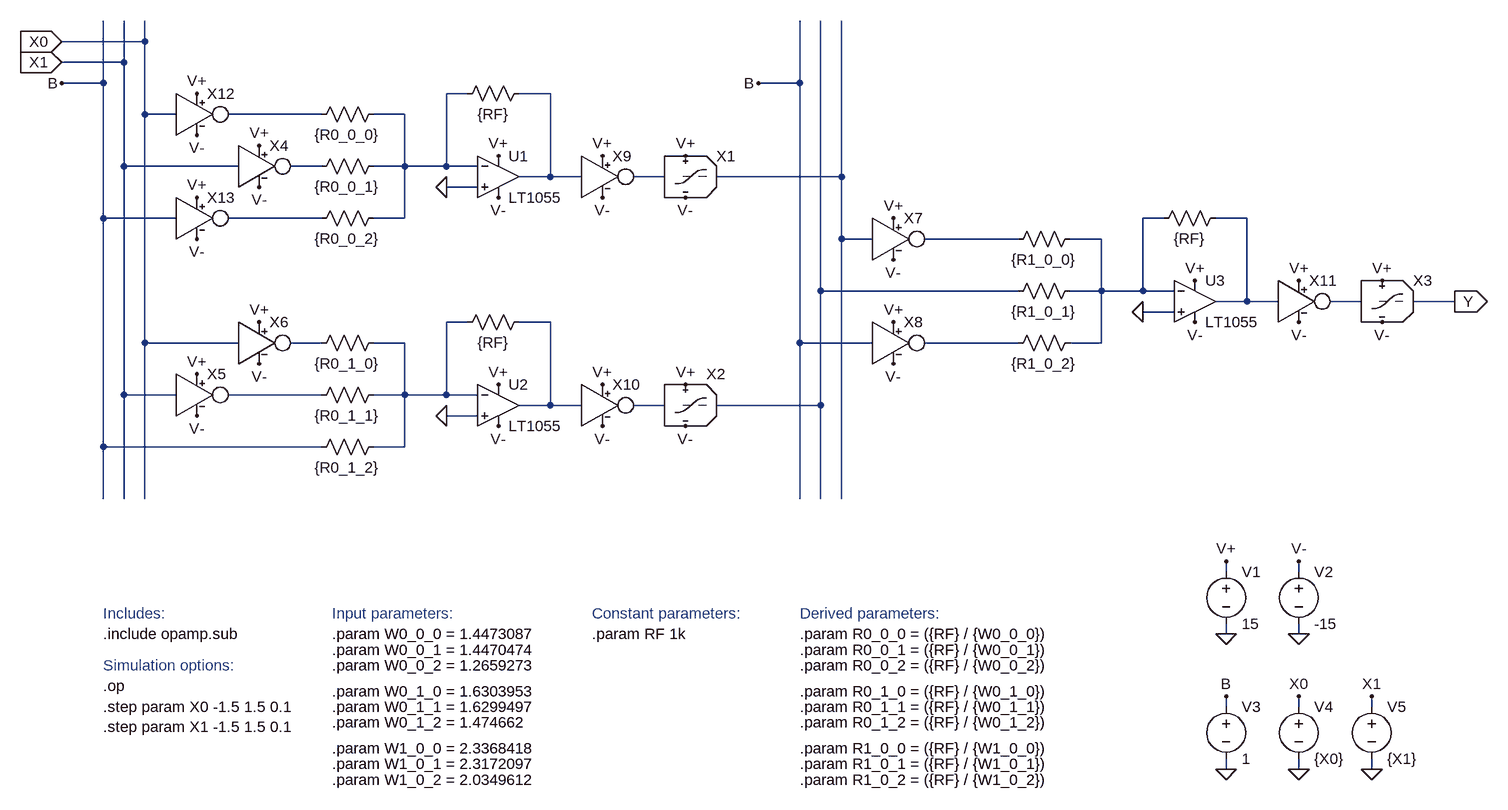
[diagram p0: schematic xor.asc]
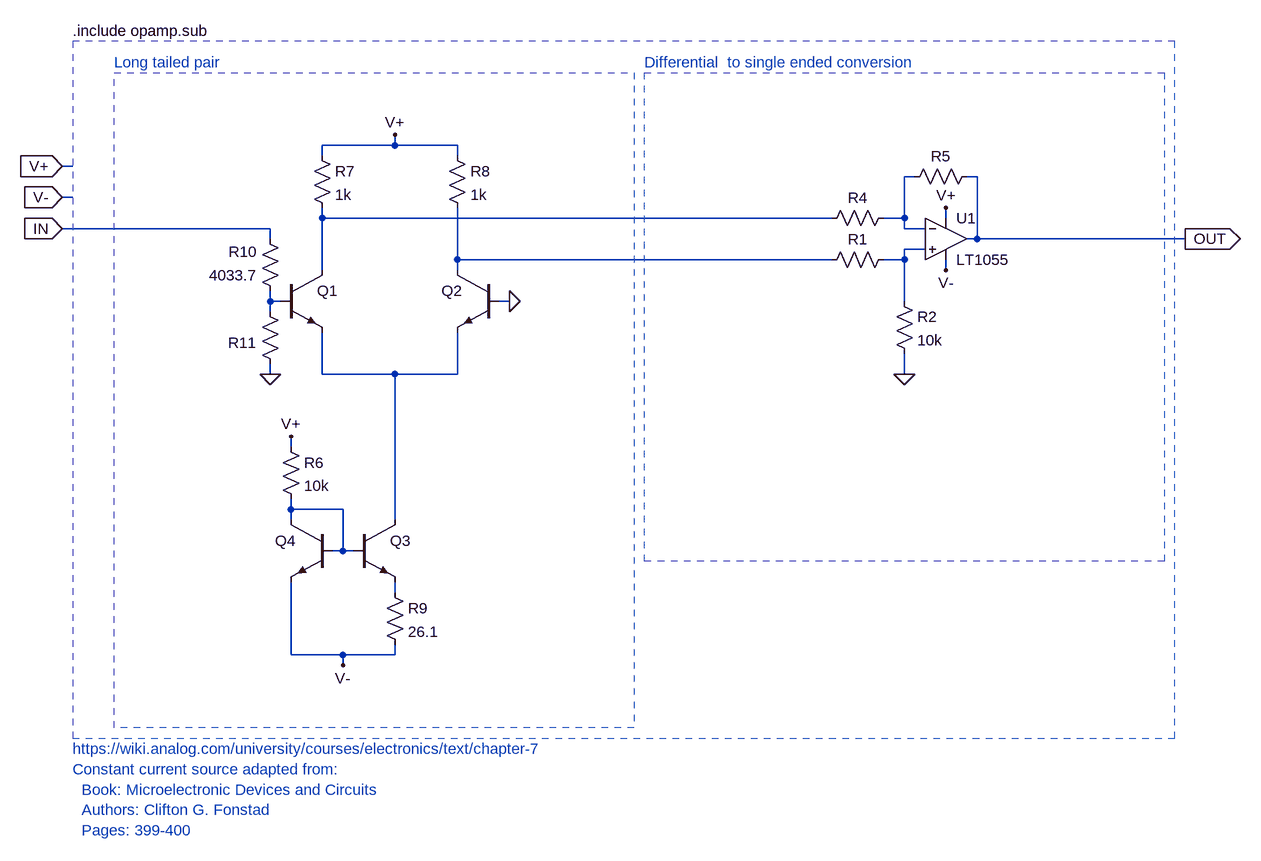
[diagram p1: sub-circuit tanh.asc]
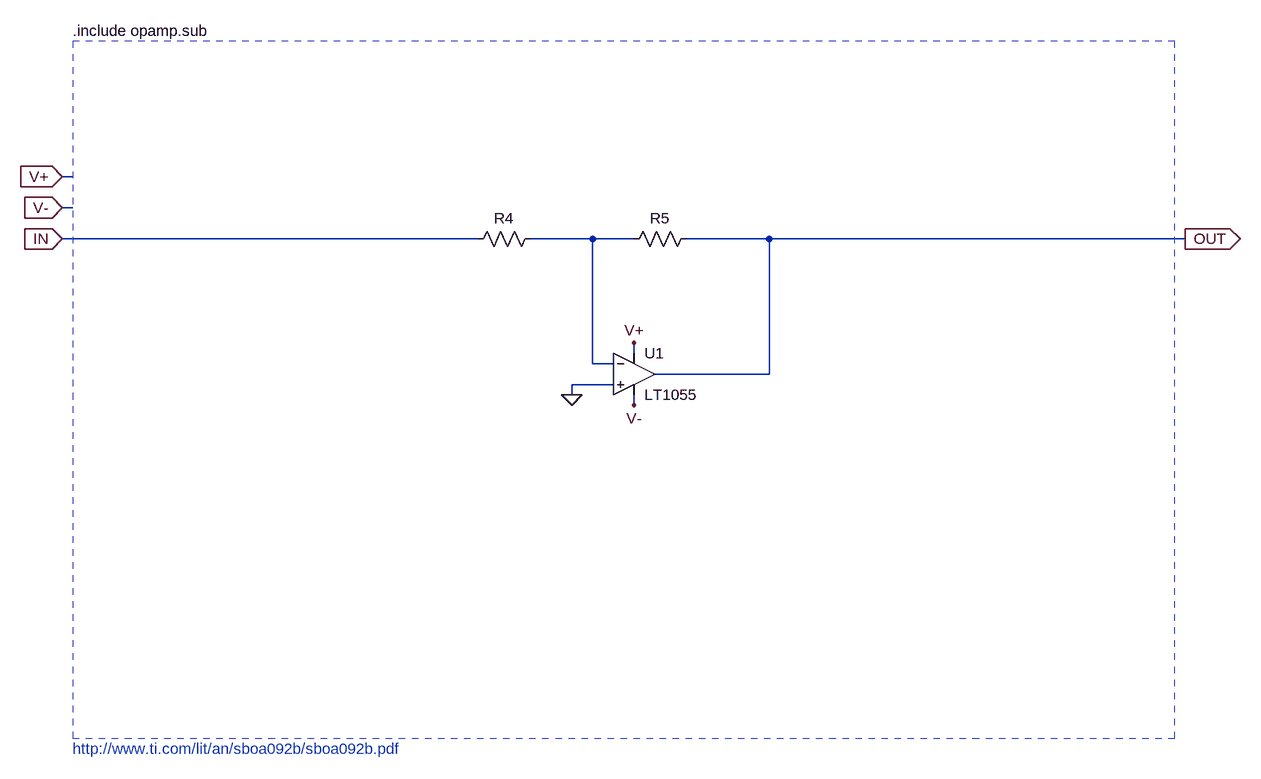
[diagram p2: sub-circuit inverter.asc]
xor.asc, the LTspice schematic file:
Version 4
SHEET 1 2576 948
WIRE -336 -448 -336 -480
WIRE -336 -448 -464 -448
WIRE -368 -416 -368 -480
WIRE -368 -416 -464 -416
WIRE -400 -384 -400 -480
WIRE -400 -384 -464 -384
WIRE 672 -384 672 -480
WIRE 672 -384 608 -384
WIRE 160 -368 128 -368
WIRE 288 -368 240 -368
WIRE -336 -336 -336 -448
WIRE -288 -336 -336 -336
WIRE -64 -336 -208 -336
WIRE 64 -336 16 -336
WIRE -368 -256 -368 -416
WIRE -192 -256 -368 -256
WIRE -64 -256 -112 -256
WIRE 64 -256 64 -336
WIRE 64 -256 16 -256
WIRE 128 -256 128 -368
WIRE 128 -256 64 -256
WIRE 176 -256 128 -256
WIRE 288 -240 288 -368
WIRE 288 -240 240 -240
WIRE 336 -240 288 -240
WIRE 464 -240 416 -240
WIRE 736 -240 736 -480
WIRE 736 -240 544 -240
WIRE 176 -224 128 -224
WIRE -400 -176 -400 -384
WIRE -288 -176 -400 -176
WIRE -64 -176 -208 -176
WIRE 64 -176 64 -256
WIRE 64 -176 16 -176
WIRE 1232 -176 1200 -176
WIRE 1360 -176 1312 -176
WIRE 736 -144 736 -240
WIRE 784 -144 736 -144
WIRE 1008 -144 864 -144
WIRE 1136 -144 1088 -144
WIRE 704 -64 704 -480
WIRE 1008 -64 704 -64
WIRE 1136 -64 1136 -144
WIRE 1136 -64 1088 -64
WIRE 1200 -64 1200 -176
WIRE 1200 -64 1136 -64
WIRE 1248 -64 1200 -64
WIRE 1360 -48 1360 -176
WIRE 1360 -48 1312 -48
WIRE 1408 -48 1360 -48
WIRE 1536 -48 1488 -48
WIRE 1680 -48 1616 -48
WIRE 1248 -32 1200 -32
WIRE 160 -16 128 -16
WIRE 288 -16 240 -16
WIRE -336 16 -336 -336
WIRE -192 16 -336 16
WIRE -64 16 -112 16
WIRE 64 16 16 16
WIRE 672 16 672 -384
WIRE 784 16 672 16
WIRE 1008 16 864 16
WIRE 1136 16 1136 -64
WIRE 1136 16 1088 16
WIRE -368 96 -368 -256
WIRE -288 96 -368 96
WIRE -64 96 -208 96
WIRE 64 96 64 16
WIRE 64 96 16 96
WIRE 128 96 128 -16
WIRE 128 96 64 96
WIRE 176 96 128 96
WIRE 288 112 288 -16
WIRE 288 112 240 112
WIRE 336 112 288 112
WIRE 464 112 416 112
WIRE 704 112 704 -64
WIRE 704 112 544 112
WIRE 176 128 128 128
WIRE -400 176 -400 -176
WIRE -64 176 -400 176
WIRE 64 176 64 96
WIRE 64 176 16 176
WIRE -400 256 -400 176
WIRE -368 256 -368 96
WIRE -336 256 -336 16
WIRE 672 256 672 16
WIRE 704 256 704 112
WIRE 736 256 736 -144
WIRE 1328 368 1328 352
WIRE 1440 368 1440 352
WIRE 1328 464 1328 448
WIRE 1440 464 1440 448
WIRE 1328 576 1328 560
WIRE 1440 576 1440 560
WIRE 1552 576 1552 560
WIRE 1328 672 1328 656
WIRE 1440 672 1440 656
WIRE 1552 672 1552 656
FLAG -464 -448 X0
IOPIN -464 -448 In
FLAG -464 -416 X1
IOPIN -464 -416 In
FLAG -464 -384 B
FLAG 208 -272 V+
FLAG 208 -208 V-
FLAG 128 -224 0
FLAG 208 80 V+
FLAG 208 144 V-
FLAG 128 128 0
FLAG 608 -384 B
FLAG 1280 -80 V+
FLAG 1280 -16 V-
FLAG 1200 -32 0
FLAG 1680 -48 Y
IOPIN 1680 -48 Out
FLAG 496 -272 V+
FLAG 496 80 V+
FLAG 1568 -80 V+
FLAG 496 -208 V-
FLAG 496 144 V-
FLAG 1568 -16 V-
FLAG 1328 464 0
FLAG 1440 464 0
FLAG 1328 352 V+
FLAG 1440 352 V-
FLAG 1328 672 0
FLAG 1440 672 0
FLAG 1552 672 0
FLAG 1440 560 X0
FLAG 1552 560 X1
FLAG 1328 560 B
FLAG -160 -288 V+
FLAG -160 -224 V-
FLAG -256 64 V+
FLAG -256 128 V-
FLAG -160 -16 V+
FLAG -160 48 V-
FLAG 816 -176 V+
FLAG 816 -112 V-
FLAG 816 -16 V+
FLAG 816 48 V-
FLAG 368 -272 V+
FLAG 368 -208 V-
FLAG 368 80 V+
FLAG 368 144 V-
FLAG 1440 -80 V+
FLAG 1440 -16 V-
FLAG -256 -368 V+
FLAG -256 -304 V-
FLAG -256 -208 V+
FLAG -256 -144 V-
SYMBOL res 32 -352 R90
WINDOW 0 -14 42 Invisible 2
WINDOW 3 32 56 VTop 2
SYMATTR InstName R1
SYMATTR Value {R0_0_0}
SYMBOL res 32 -272 R90
WINDOW 0 0 56 Invisible 2
WINDOW 3 32 56 VTop 2
SYMATTR InstName R2
SYMATTR Value {R0_0_1}
SYMBOL res 32 -192 R90
WINDOW 0 0 56 Invisible 2
WINDOW 3 32 56 VTop 2
SYMATTR InstName R3
SYMATTR Value {R0_0_2}
SYMBOL res 256 -384 R90
WINDOW 0 -14 42 Invisible 2
WINDOW 3 32 56 VTop 2
SYMATTR InstName R4
SYMATTR Value {RF}
SYMBOL res 32 0 R90
WINDOW 0 -14 42 Invisible 2
WINDOW 3 32 56 VTop 2
SYMATTR InstName R5
SYMATTR Value {R0_1_0}
SYMBOL res 32 80 R90
WINDOW 0 0 56 Invisible 2
WINDOW 3 32 56 VTop 2
SYMATTR InstName R6
SYMATTR Value {R0_1_1}
SYMBOL res 32 160 R90
WINDOW 0 0 56 Invisible 2
WINDOW 3 32 56 VTop 2
SYMATTR InstName R7
SYMATTR Value {R0_1_2}
SYMBOL res 256 -32 R90
WINDOW 0 -14 42 Invisible 2
WINDOW 3 32 56 VTop 2
SYMATTR InstName R8
SYMATTR Value {RF}
SYMBOL res 1104 -160 R90
WINDOW 0 -14 42 Invisible 2
WINDOW 3 32 56 VTop 2
SYMATTR InstName R9
SYMATTR Value {R1_0_0}
SYMBOL res 1104 -80 R90
WINDOW 0 0 56 Invisible 2
WINDOW 3 32 56 VTop 2
SYMATTR InstName R10
SYMATTR Value {R1_0_1}
SYMBOL res 1104 0 R90
WINDOW 0 0 56 Invisible 2
WINDOW 3 32 56 VTop 2
SYMATTR InstName R11
SYMATTR Value {R1_0_2}
SYMBOL res 1328 -192 R90
WINDOW 0 -14 42 Invisible 2
WINDOW 3 32 56 VTop 2
SYMATTR InstName R12
SYMATTR Value {RF}
SYMBOL tanh 496 -304 R0
WINDOW 0 48 32 Left 2
SYMATTR InstName X1
SYMBOL tanh 496 48 R0
WINDOW 0 32 16 Left 2
SYMATTR InstName X2
SYMBOL tanh 1568 -112 R0
WINDOW 0 48 32 Left 2
SYMATTR InstName X3
SYMBOL voltage 1328 352 R0
WINDOW 123 0 0 Left 0
WINDOW 39 0 0 Left 0
SYMATTR InstName V1
SYMATTR Value 15
SYMBOL voltage 1440 352 R0
WINDOW 123 0 0 Left 0
WINDOW 39 0 0 Left 0
SYMATTR InstName V2
SYMATTR Value -15
SYMBOL Opamps\\LT1055 208 -304 R0
SYMATTR InstName U1
SYMBOL Opamps\\LT1055 208 48 R0
SYMATTR InstName U2
SYMBOL Opamps\\LT1055 1280 -112 R0
SYMATTR InstName U3
SYMBOL voltage 1328 560 R0
WINDOW 123 0 0 Left 0
WINDOW 39 0 0 Left 0
SYMATTR InstName V3
SYMATTR Value 1
SYMBOL voltage 1440 560 R0
WINDOW 123 0 0 Left 0
WINDOW 39 0 0 Left 0
SYMATTR InstName V4
SYMATTR Value {X0}
SYMBOL voltage 1552 560 R0
WINDOW 123 0 0 Left 0
WINDOW 39 0 0 Left 0
SYMATTR InstName V5
SYMATTR Value {X1}
SYMBOL inverter -160 -320 R0
SYMATTR InstName X4
SYMBOL inverter -256 32 R0
SYMATTR InstName X5
SYMBOL inverter -160 -48 R0
SYMATTR InstName X6
SYMBOL inverter 816 -208 R0
SYMATTR InstName X7
SYMBOL inverter 816 -48 R0
SYMATTR InstName X8
SYMBOL inverter 368 -304 R0
SYMATTR InstName X9
SYMBOL inverter 368 48 R0
SYMATTR InstName X10
SYMBOL inverter 1440 -112 R0
SYMATTR InstName X11
SYMBOL inverter -256 -400 R0
SYMATTR InstName X12
SYMBOL inverter -256 -240 R0
SYMATTR InstName X13
TEXT 352 464 Left 2 !.param RF 1k
TEXT 672 464 Left 2 !.param R0_0_0 = ({RF} / {W0_0_0})
TEXT 672 488 Left 2 !.param R0_0_1 = ({RF} / {W0_0_1})
TEXT 672 512 Left 2 !.param R0_0_2 = ({RF} / {W0_0_2})
TEXT 672 552 Left 2 !.param R0_1_0 = ({RF} / {W0_1_0})
TEXT 672 576 Left 2 !.param R0_1_1 = ({RF} / {W0_1_1})
TEXT 672 600 Left 2 !.param R0_1_2 = ({RF} / {W0_1_2})
TEXT 672 640 Left 2 !.param R1_0_0 = ({RF} / {W1_0_0})
TEXT 672 664 Left 2 !.param R1_0_1 = ({RF} / {W1_0_1})
TEXT 672 688 Left 2 !.param R1_0_2 = ({RF} / {W1_0_2})
TEXT -48 464 Left 2 !.param W0_0_0 = 1.4473087
TEXT -48 488 Left 2 !.param W0_0_1 = 1.4470474
TEXT -48 512 Left 2 !.param W0_0_2 = 1.2659273
TEXT -48 552 Left 2 !.param W0_1_0 = 1.6303953
TEXT -48 576 Left 2 !.param W0_1_1 = 1.6299497
TEXT -48 600 Left 2 !.param W0_1_2 = 1.474662
TEXT -48 640 Left 2 !.param W1_0_0 = 2.3368418
TEXT -48 664 Left 2 !.param W1_0_1 = 2.3172097
TEXT -48 688 Left 2 !.param W1_0_2 = 2.0349612
TEXT -400 464 Left 2 !.include opamp.sub
TEXT -400 576 Left 2 !.step param X0 -1.5 1.5 0.1\n.step param X1 -1.5 1.5 0.1
TEXT -400 544 Left 2 !.op
TEXT 352 432 Left 2 ;Constant parameters:
TEXT 672 432 Left 2 ;Derived parameters:
TEXT -48 432 Left 2 ;Input parameters:
TEXT -400 512 Left 2 ;Simulation options:
TEXT -400 432 Left 2 ;Includes:

tanh.asc, the sub-circuit schematic file:
Version 4
SHEET 1 3332 1252
WIRE 1840 192 1840 176
WIRE 1840 192 1728 192
WIRE 1936 192 1840 192
WIRE 1728 208 1728 192
WIRE 1936 208 1936 192
WIRE 1344 224 1328 224
WIRE 2640 240 2624 240
WIRE 2736 240 2720 240
WIRE 1344 272 1328 272
WIRE 1728 304 1728 288
WIRE 2512 304 1728 304
WIRE 2624 304 2624 240
WIRE 2624 304 2592 304
WIRE 2688 304 2688 288
WIRE 1648 320 1328 320
WIRE 2624 320 2624 304
WIRE 2656 320 2624 320
WIRE 1648 336 1648 320
WIRE 2736 336 2736 240
WIRE 2736 336 2720 336
WIRE 3056 336 2736 336
WIRE 2656 352 2624 352
WIRE 1936 368 1936 288
WIRE 2512 368 1936 368
WIRE 2624 368 2624 352
WIRE 2624 368 2592 368
WIRE 1728 384 1728 304
WIRE 1936 384 1936 368
WIRE 2688 384 2688 368
WIRE 1648 432 1648 416
WIRE 1664 432 1648 432
WIRE 2016 432 2000 432
WIRE 2624 432 2624 368
WIRE 1648 448 1648 432
WIRE 1648 544 1648 528
WIRE 1728 544 1728 480
WIRE 1840 544 1728 544
WIRE 1936 544 1936 480
WIRE 1936 544 1840 544
WIRE 2624 544 2624 512
WIRE 1680 656 1680 640
WIRE 1680 752 1680 736
WIRE 1760 752 1680 752
WIRE 1680 768 1680 752
WIRE 1840 768 1840 544
WIRE 1760 816 1760 752
WIRE 1760 816 1744 816
WIRE 1776 816 1760 816
WIRE 1840 880 1840 864
WIRE 1680 976 1680 864
WIRE 1760 976 1680 976
WIRE 1840 976 1840 960
WIRE 1840 976 1760 976
WIRE 1760 992 1760 976
FLAG 2688 288 V+
FLAG 2688 384 V-
FLAG 2016 432 0
FLAG 1840 176 V+
FLAG 1648 544 0
FLAG 2624 544 0
FLAG 1760 992 V-
FLAG 1328 320 IN
IOPIN 1328 320 In
FLAG 3056 336 OUT
IOPIN 3056 336 Out
FLAG 1328 224 V+
IOPIN 1328 224 In
FLAG 1328 272 V-
IOPIN 1328 272 In
FLAG 1680 640 V+
SYMBOL res 2496 320 R270
WINDOW 0 32 56 VTop 2
WINDOW 3 0 56 Invisible 2
SYMATTR InstName R4
SYMATTR Value 10k
SYMBOL res 2736 224 R90
WINDOW 0 0 56 VBottom 2
WINDOW 3 32 56 Invisible 2
SYMATTR InstName R5
SYMATTR Value 10k
SYMBOL Opamps\\LT1055 2688 272 R0
SYMATTR InstName U1
SYMBOL npn 1664 384 R0
WINDOW 3 56 68 Invisible 2
SYMATTR Value 2N2222
SYMATTR InstName Q1
SYMBOL npn 2000 384 M0
WINDOW 3 56 68 Invisible 2
SYMATTR Value 2N2222
SYMATTR InstName Q2
SYMBOL res 1712 192 R0
SYMATTR InstName R7
SYMATTR Value 1k
SYMBOL res 1920 192 R0
SYMATTR InstName R8
SYMATTR Value 1k
SYMBOL res 1664 432 R180
WINDOW 0 36 76 Left 2
WINDOW 3 36 40 Left 2
SYMATTR InstName R10
SYMATTR Value 4033.7
SYMBOL res 1664 544 R180
WINDOW 0 37 48 Left 2
WINDOW 3 36 40 Invisible 2
SYMATTR InstName R11
SYMATTR Value 220
SYMBOL res 2496 384 R270
WINDOW 0 32 56 VTop 2
WINDOW 3 0 56 Invisible 2
SYMATTR InstName R1
SYMATTR Value 10k
SYMBOL res 2608 416 R0
SYMATTR InstName R2
SYMATTR Value 10k
SYMBOL npn 1776 768 R0
WINDOW 3 56 68 Invisible 2
SYMATTR Value 2N2222
SYMATTR InstName Q3
SYMBOL npn 1744 768 M0
WINDOW 3 56 68 Invisible 2
SYMATTR Value 2N2222
SYMATTR InstName Q4
SYMBOL res 1664 640 R0
SYMATTR InstName R6
SYMATTR Value 10k
SYMBOL res 1824 864 R0
SYMATTR InstName R9
SYMATTR Value 26.1
TEXT 1344 16 Left 2 !.include opamp.sub
TEXT 1344 1120 Left 2 ;https://wiki.analog.com/university/courses/electronics/text/chapter-7
TEXT 1408 64 Left 2 ;Long tailed pair
TEXT 2224 64 Left 2 ;Differential  to single ended conversion
TEXT 1344 1152 Left 2 ;Constant current source adapted from:\n  Book: Microelectronic Devices and Circuits\n  Authors: Clifton G. Fonstad\n  Pages: 399-400
RECTANGLE Normal 2208 1088 1408 80 2
RECTANGLE Normal 3024 832 2224 80 2
RECTANGLE Normal 3040 32 1344 1104 2

inverter.asc, the sub-circuit schematic file:
Version 4
SHEET 1 3332 1252
WIRE 1344 240 1328 240
WIRE 1344 288 1328 288
WIRE 1968 336 1328 336
WIRE 2144 336 2048 336
WIRE 2208 336 2144 336
WIRE 2416 336 2288 336
WIRE 3056 336 2416 336
WIRE 2208 512 2208 496
WIRE 2144 528 2144 336
WIRE 2176 528 2144 528
WIRE 2416 544 2416 336
WIRE 2416 544 2240 544
WIRE 2176 560 2112 560
WIRE 2112 576 2112 560
WIRE 2208 592 2208 576
FLAG 2208 496 V+
FLAG 2208 592 V-
FLAG 1328 336 IN
IOPIN 1328 336 In
FLAG 3056 336 OUT
IOPIN 3056 336 Out
FLAG 1328 240 V+
IOPIN 1328 240 In
FLAG 1328 288 V-
IOPIN 1328 288 In
FLAG 2112 576 0
SYMBOL res 1952 352 R270
WINDOW 0 32 56 VTop 2
WINDOW 3 0 56 Invisible 2
SYMATTR InstName R4
SYMATTR Value 10k
SYMBOL res 2304 320 R90
WINDOW 0 0 56 VBottom 2
WINDOW 3 32 56 Invisible 2
SYMATTR InstName R5
SYMATTR Value 10k
SYMBOL Opamps\\LT1055 2208 480 R0
SYMATTR InstName U1
TEXT 1344 16 Left 2 !.include opamp.sub
TEXT 1344 1120 Left 2 ;http://www.ti.com/lit/an/sboa092b/sboa092b.pdf
RECTANGLE Normal 3040 32 1344 1104 2

The netlist it stands for:
* xor.asc
R1 N001 N003 {R0_0_0}
R2 N001 N004 {R0_0_1}
R3 N001 N007 {R0_0_2}
R4 N002 N001 {RF}
R5 N013 N015 {R0_1_0}
R6 N013 N017 {R0_1_1}
R7 N013 B {R0_1_2}
R8 N014 N013 {RF}
R9 N008 N010 {R1_0_0}
R10 N008 N011 {R1_0_1}
R11 N008 N016 {R1_0_2}
R12 N009 N008 {RF}
XX1 N005 V+ V- N006 tanh
XX2 N018 V+ V- N011 tanh
XX3 N012 V+ V- Y tanh
V1 V+ 0 15
V2 V- 0 -15
XU1 0 N001 V+ V- N002 LT1055  ; pins In+ In- V+ V- OUT
XU2 0 N013 V+ V- N014 LT1055  ; pins In+ In- V+ V- OUT
XU3 0 N008 V+ V- N009 LT1055  ; pins In+ In- V+ V- OUT
V3 B 0 1
V4 X0 0 {X0}
V5 X1 0 {X1}
XX4 X1 V+ V- N004 inverter
XX5 X1 V+ V- N017 inverter
XX6 X0 V+ V- N015 inverter
XX7 N006 V+ V- N010 inverter
XX8 B V+ V- N016 inverter
XX9 N002 V+ V- N005 inverter
XX10 N014 V+ V- N018 inverter
XX11 N009 V+ V- N012 inverter
XX12 X0 V+ V- N003 inverter
XX13 B V+ V- N007 inverter

* block symbol definitions
.subckt tanh IN V+ V- OUT
R4 N002 N001 10k
R5 OUT N001 10k
XU1 N003 N001 V+ V- OUT LT1055  ; pins In+ In- V+ V- OUT
Q1 N002 N005 N006 0 2N2222
Q2 N004 0 N006 0 2N2222
R7 V+ N002 1k
R8 V+ N004 1k
R10 N005 IN 4033.7
R11 0 N005 220
R1 N004 N003 10k
R2 N003 0 10k
Q3 N006 N007 N008 0 2N2222
Q4 N007 N007 V- 0 2N2222
R6 V+ N007 10k
R9 N008 V- 26.1
.include opamp.sub
* https://wiki.analog.com/university/courses/electronics/text/chapter-7
* Long tailed pair
* Differential  to single ended conversion
* Constant current source adapted from:
*   Book: Microelectronic Devices and Circuits
*   Authors: Clifton G. Fonstad
*   Pages: 399-400
.ends tanh

.subckt inverter IN V+ V- OUT
R4 IN N001 10k
R5 OUT N001 10k
XU1 0 N001 V+ V- OUT LT1055  ; pins In+ In- V+ V- OUT
.include opamp.sub
* http://www.ti.com/lit/an/sboa092b/sboa092b.pdf
.ends inverter

.model NPN NPN
.model PNP PNP
.lib standard.bjt
.param RF 1k
.param R0_0_0 = ({RF} / {W0_0_0})
.param R0_0_1 = ({RF} / {W0_0_1})
.param R0_0_2 = ({RF} / {W0_0_2})
.param R0_1_0 = ({RF} / {W0_1_0})
.param R0_1_1 = ({RF} / {W0_1_1})
.param R0_1_2 = ({RF} / {W0_1_2})
.param R1_0_0 = ({RF} / {W1_0_0})
.param R1_0_1 = ({RF} / {W1_0_1})
.param R1_0_2 = ({RF} / {W1_0_2})
.param W0_0_0 = 1.4473087
.param W0_0_1 = 1.4470474
.param W0_0_2 = 1.2659273
.param W0_1_0 = 1.6303953
.param W0_1_1 = 1.6299497
.param W0_1_2 = 1.474662
.param W1_0_0 = 2.3368418
.param W1_0_1 = 2.3172097
.param W1_0_2 = 2.0349612
.include opamp.sub
.step param X0 -1.5 1.5 0.1
.step param X1 -1.5 1.5 0.1
.op
* Constant parameters:
* Derived parameters:
* Input parameters:
* Simulation options:
* Includes:
.backanno
.end

* Results of the author's LTspice run, read from the files saved beside the schematic
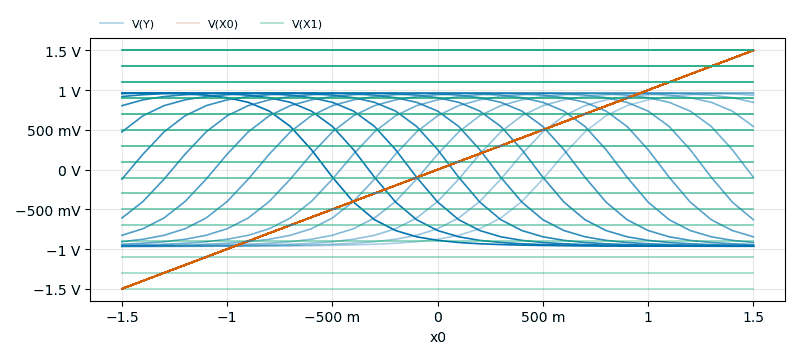
[diagram p3: Operating Point of xor.asc, plotted from the saved traces]
* Operating Point, 31 runs:
*   V(Y) [run 1]: -966.9 mV at x0=-1.5 , 965 mV at x0=1.5 , min -966.9 mV, max 965 mV
*   V(Y) [run 2]: -966.3 mV at x0=-1.5 , 960.9 mV at x0=1.5 , min -966.3 mV, max 965 mV
*   V(Y) [run 3]: -965.3 mV at x0=-1.5 , 935.8 mV at x0=1.5 , min -965.3 mV, max 965 mV
*   V(Y) [run 4]: -963.5 mV at x0=-1.5 , 845.8 mV at x0=1.5 , min -963.5 mV, max 965 mV
*   V(Y) [run 5]: -960 mV at x0=-1.5 , 541.7 mV at x0=1.5 , min -960 mV, max 965 mV
*   V(Y) [run 6]: -953.3 mV at x0=-1.5 , -97.82 mV at x0=1.5 , min -953.3 mV, max 965 mV
*   V(Y) [run 7]: -939.3 mV at x0=-1.5 , -631.5 mV at x0=1.5 , min -939.3 mV, max 965 mV
*   V(Y) [run 8]: -907.5 mV at x0=-1.5 , -845.7 mV at x0=1.5 , min -907.5 mV, max 965 mV
*   V(X0) [run 1]: -1.5 V at x0=-1.5 , 1.5 V at x0=1.5 , min -1.5 V, max 1.5 V
*   V(X0) [run 2]: -1.5 V at x0=-1.5 , 1.5 V at x0=1.5 , min -1.5 V, max 1.5 V
*   V(X0) [run 3]: -1.5 V at x0=-1.5 , 1.5 V at x0=1.5 , min -1.5 V, max 1.5 V
*   V(X0) [run 4]: -1.5 V at x0=-1.5 , 1.5 V at x0=1.5 , min -1.5 V, max 1.5 V
*   V(X0) [run 5]: -1.5 V at x0=-1.5 , 1.5 V at x0=1.5 , min -1.5 V, max 1.5 V
*   V(X0) [run 6]: -1.5 V at x0=-1.5 , 1.5 V at x0=1.5 , min -1.5 V, max 1.5 V
*   V(X0) [run 7]: -1.5 V at x0=-1.5 , 1.5 V at x0=1.5 , min -1.5 V, max 1.5 V
*   V(X0) [run 8]: -1.5 V at x0=-1.5 , 1.5 V at x0=1.5 , min -1.5 V, max 1.5 V
*   V(X1) [run 1]: -1.5 V at x0=-1.5 , -1.5 V at x0=1.5 , min -1.5 V, max -1.5 V
*   V(X1) [run 2]: -1.3 V at x0=-1.5 , -1.3 V at x0=1.5 , min -1.3 V, max -1.3 V
*   V(X1) [run 3]: -1.1 V at x0=-1.5 , -1.1 V at x0=1.5 , min -1.1 V, max -1.1 V
*   V(X1) [run 4]: -900 mV at x0=-1.5 , -900 mV at x0=1.5 , min -900 mV, max -900 mV
*   V(X1) [run 5]: -700 mV at x0=-1.5 , -700 mV at x0=1.5 , min -700 mV, max -700 mV
*   V(X1) [run 6]: -500 mV at x0=-1.5 , -500 mV at x0=1.5 , min -500 mV, max -500 mV
*   V(X1) [run 7]: -300 mV at x0=-1.5 , -300 mV at x0=1.5 , min -300 mV, max -300 mV
*   V(X1) [run 8]: -100 mV at x0=-1.5 , -100 mV at x0=1.5 , min -100 mV, max -100 mV